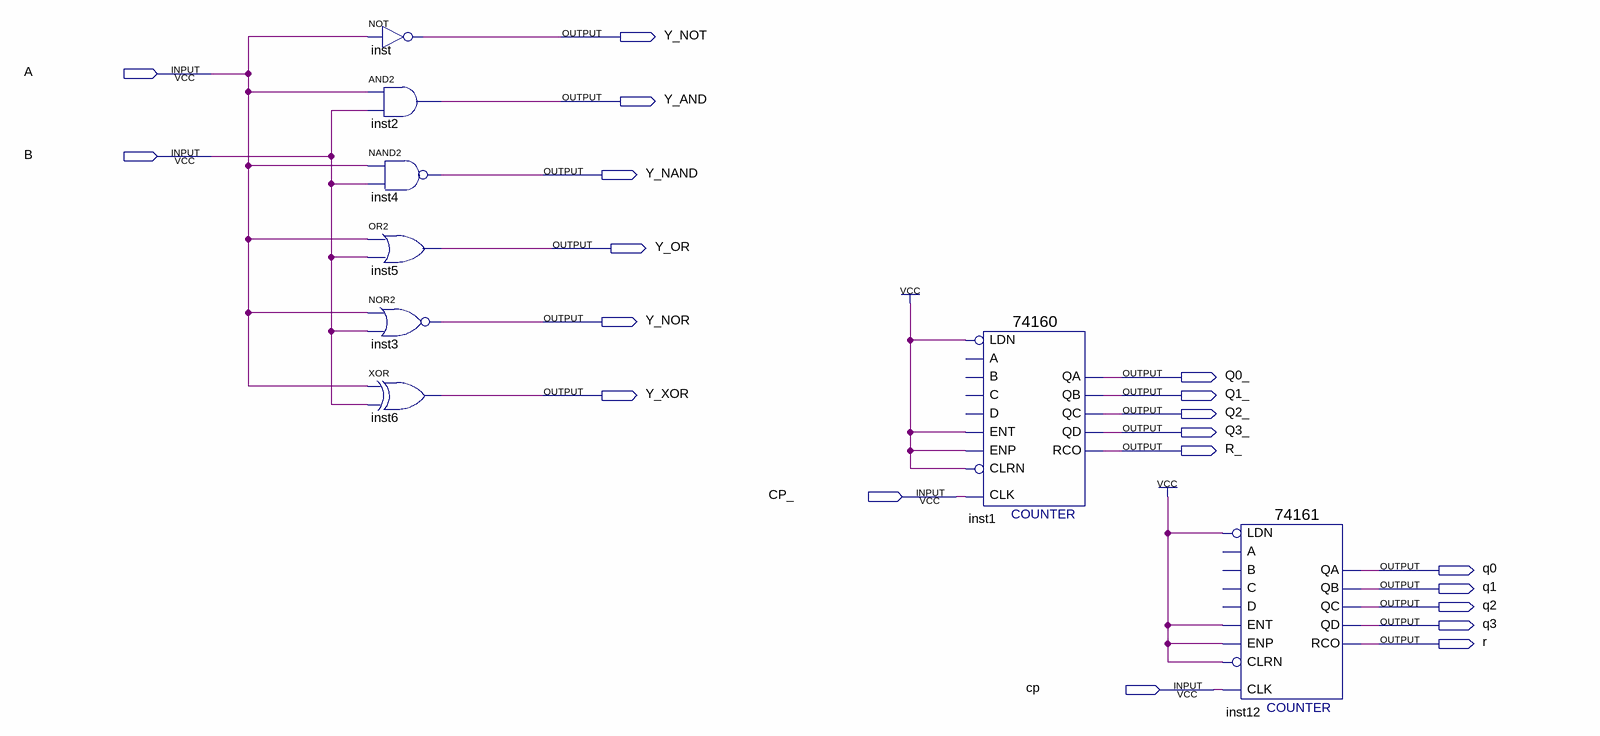
[diagram p0: schematic sheet]
// Quartus schematic lab1.bdf as structural Verilog: 8 symbols, 20 pins
module lab1 (
  input  A,
  input  B,
  input  CP_,
  input  cp,
  output Y_NOT,
  output Y_AND,
  output Y_NAND,
  output Y_OR,
  output Y_NOR,
  output Q0_,
  output Y_XOR,
  output Q1_,
  output Q2_,
  output Q3_,
  output R_,
  output q0,
  output q1,
  output q2,
  output q3,
  output r
);

  not inst (Y_NOT, A);
  and inst2 (Y_AND, A, B);
  nand inst4 (Y_NAND, A, B);
  or inst5 (Y_OR, A, B);
  nor inst3 (Y_NOR, A, B);
  xor inst6 (Y_XOR, A, B);
  \74160  inst1 (
    .CLK(CP_), .ENT(1'b1), .LDN(1'b1), .ENP(1'b1), .CLRN(1'b1), .QD(Q3_), .QA(Q0_), .QB(Q1_), .QC(Q2_),
    .RCO(R_));  // open: A, B, C, D
  \74161  inst12 (
    .CLRN(1'b1), .CLK(cp), .ENP(1'b1), .LDN(1'b1), .ENT(1'b1), .QD(q3), .QC(q2), .QB(q1), .QA(q0), .RCO(r));  // open: A, D, B, C
endmodule
